# EAGLE schematic robLip6_lowlevel (EAGLE 7.5.0)
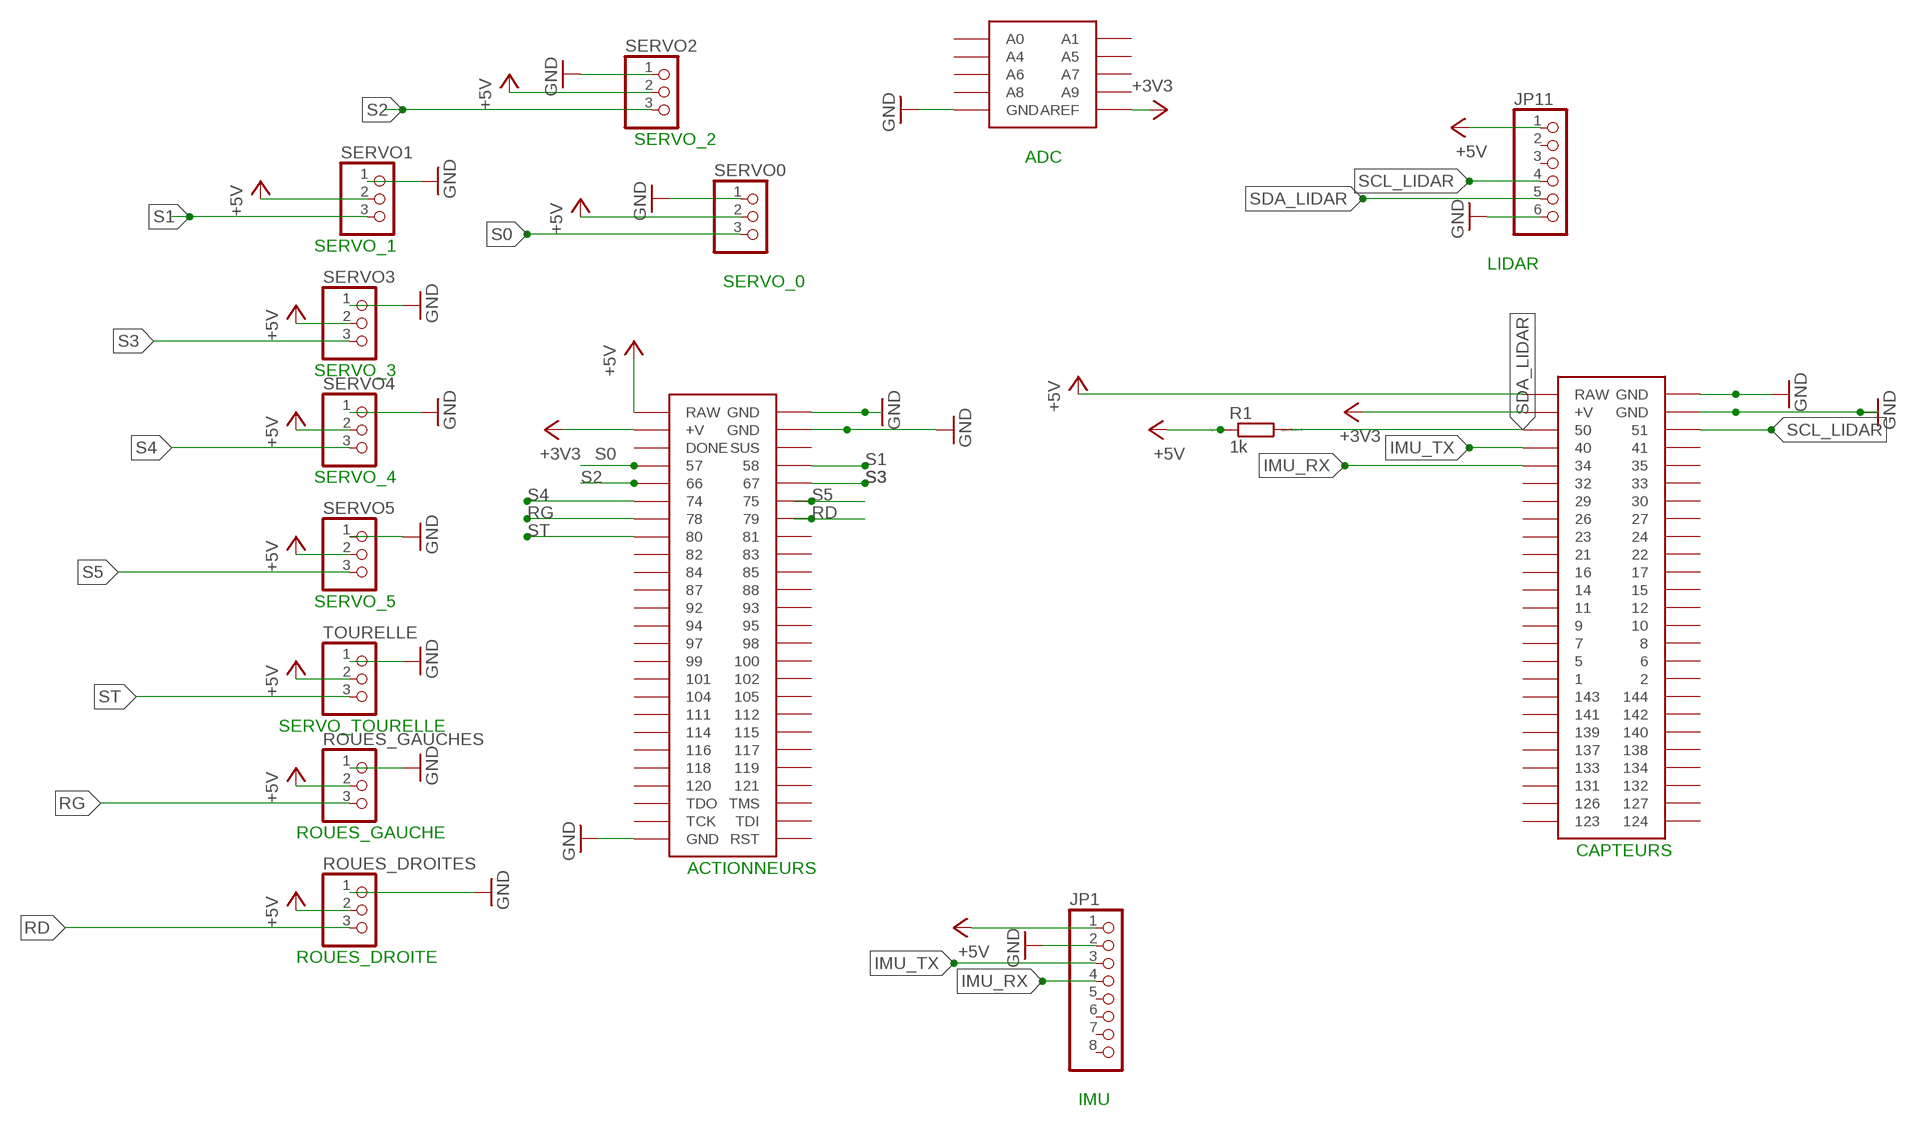
[diagram p0: schematic, sheet 1]

## Parts
JP1  PINHD-1X8  [1X08]
JP11  PINHD-1X6  [1X06]
R1  1k  R0207/10  [0207/10]
ROUES_DROITES  PINHD-1X3/90  [1X03/90]
ROUES_GAUCHES  PINHD-1X3/90  [1X03/90]
SERVO0  PINHD-1X3/90  [1X03/90]
SERVO1  PINHD-1X3/90  [1X03/90]
SERVO2  PINHD-1X3/90  [1X03/90]
SERVO3  PINHD-1X3/90  [1X03/90]
SERVO4  PINHD-1X3/90  [1X03/90]
SERVO5  PINHD-1X3/90  [1X03/90]
TOURELLE  PINHD-1X3/90  [1X03/90]
U$1  MOJOV3  [MOJO_V3]

## Nets
+3V3: U$1.AREF U$1.V@1(+V) U$1.V@2(+V)
+5V: JP1.1 JP11.1 R1.1 ROUES_DROITES.2 ROUES_GAUCHES.2 SERVO0.2 SERVO1.2 SERVO2.2 SERVO3.2 SERVO4.2 SERVO5.2 TOURELLE.2 U$1.RAW@1(RAW)
GND: JP1.2 JP11.6 ROUES_DROITES.1 ROUES_GAUCHES.1 SERVO0.1 SERVO1.1 SERVO2.1 SERVO3.1 SERVO4.1 SERVO5.1 TOURELLE.1 U$1.GND@2(GND) U$1.GND@3(GND) U$1.GND@4(GND) U$1.GND@5(GND) U$1.GND@6(GND)
GND@1: U$1.GND@1(GND) ; supply symbol labelled GND
IMU_RX: JP1.4 U$1.34
IMU_TX: JP1.3 U$1.40
RAW: U$1.RAW@2(RAW) ; supply symbol labelled +5V
RD: ROUES_DROITES.3 U$1.79
RG: ROUES_GAUCHES.3 U$1.78
S0: SERVO0.3 U$1.57
S1: SERVO1.3 U$1.58
S2: SERVO2.3 U$1.66
S3: SERVO3.3 U$1.67
S4: SERVO4.3 U$1.74
S5: SERVO5.3 U$1.75
SCL_LIDAR: JP11.4 U$1.51
SDA_LIDAR: JP11.5 R1.2 U$1.50
ST: TOURELLE.3 U$1.80
Unconnected: JP1.5 JP1.6 JP1.7 JP1.8 JP11.2 JP11.3 U$1.1 U$1.2 U$1.5 U$1.6 U$1.7 U$1.8 U$1.9 U$1.10 U$1.11 U$1.12 U$1.14 U$1.15 U$1.16 U$1.17 U$1.21 U$1.22 U$1.23 U$1.24 U$1.26 U$1.27 U$1.29 U$1.30 U$1.32 U$1.33 U$1.35 U$1.41 U$1.81 U$1.82 U$1.83 U$1.84 U$1.85 U$1.87 U$1.88 U$1.92 U$1.93 U$1.94 U$1.95 U$1.97 U$1.98 U$1.99 U$1.100 U$1.101 U$1.102 U$1.104 U$1.105 U$1.111 U$1.112 U$1.114 U$1.115 U$1.116 U$1.117 U$1.118 U$1.119 U$1.120 U$1.121 U$1.123 U$1.124 U$1.126 U$1.127 U$1.131 U$1.132 U$1.133 U$1.134 U$1.137 U$1.138 U$1.139 U$1.140 U$1.141 U$1.142 U$1.143 U$1.144 U$1.A0 U$1.A1 U$1.A4 U$1.A5 U$1.A6 U$1.A7 U$1.A8 U$1.A9 U$1.DONE U$1.RST U$1.SUS U$1.TCK U$1.TDI U$1.TDO U$1.TMS

## Notes on the sheet
- SERVO_2
- ADC
- SERVO_1
- LIDAR
- SERVO_0
- SERVO_3
- SERVO_4
- SERVO_5
- SERVO_TOURELLE
- ROUES_GAUCHE
- CAPTEURS
- ACTIONNEURS
- ROUES_DROITE
- IMU

## Library data of the parts
JP1 = pinhead:PINHD-1X8: PIN HEADER
JP11 = pinhead:PINHD-1X6: PIN HEADER
R1 = eagle-ltspice:R: RESISTOR, European symbol; SPICEMODEL: NONE; SPICEPREFIX: R
ROUES_DROITES ROUES_GAUCHES SERVO0 SERVO1-SERVO5 TOURELLE = pinhead:PINHD-1X3: PIN HEADER
U$1 = EmbeddedMicro-Mojo:MOJO

## Net classes
0 default: width 0.305 mm, drill 0.508 mm, clearance 0.254 mm